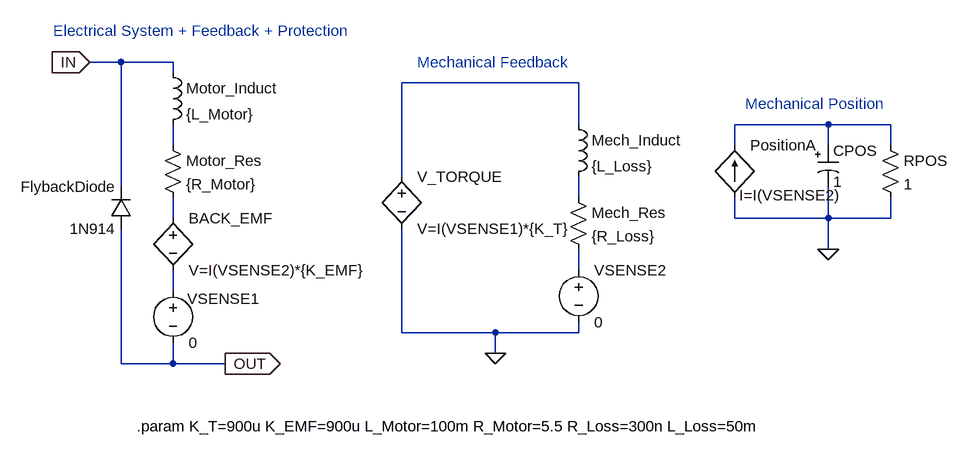
[diagram p0: schematic DCMotorCircuitModel.asc]
DCMotorCircuitModel.asc, the LTspice schematic file:
Version 4
SHEET 1 1356 808
WIRE -176 48 -224 48
WIRE -96 48 -176 48
WIRE -96 64 -96 48
WIRE 528 80 256 80
WIRE 528 144 528 80
WIRE 912 144 768 144
WIRE 1008 144 912 144
WIRE -96 176 -96 144
WIRE 768 176 768 144
WIRE 912 176 912 144
WIRE 1008 176 1008 144
WIRE 256 224 256 80
WIRE -176 240 -176 48
WIRE 528 256 528 224
WIRE -96 288 -96 256
WIRE 768 288 768 256
WIRE 912 288 912 240
WIRE 912 288 768 288
WIRE 1008 288 1008 256
WIRE 1008 288 912 288
WIRE 912 336 912 288
WIRE 528 368 528 336
WIRE -96 400 -96 368
WIRE 256 464 256 304
WIRE 400 464 256 464
WIRE 528 464 528 448
WIRE 528 464 400 464
WIRE 400 496 400 464
WIRE -176 512 -176 304
WIRE -96 512 -96 480
WIRE -96 512 -176 512
WIRE -16 512 -96 512
FLAG -224 48 IN
IOPIN -224 48 In
FLAG -16 512 OUT
IOPIN -16 512 Out
FLAG 400 496 0
FLAG 912 336 0
SYMBOL ind -112 48 R0
SYMATTR InstName Motor_Induct
SYMATTR Value {L_Motor}
SYMBOL res -112 160 R0
SYMATTR InstName Motor_Res
SYMATTR Value {R_Motor}
SYMBOL voltage -96 384 R0
WINDOW 0 22 28 Left 2
SYMATTR InstName VSENSE1
SYMATTR Value 0
SYMBOL voltage 528 352 R0
WINDOW 123 0 0 Left 2
WINDOW 39 0 0 Left 2
SYMATTR InstName VSENSE2
SYMATTR Value 0
SYMBOL ind 512 128 R0
SYMATTR InstName Mech_Induct
SYMATTR Value {L_Loss}
SYMBOL res 512 240 R0
SYMATTR InstName Mech_Res
SYMATTR Value {R_Loss}
SYMBOL polcap 896 176 R0
WINDOW 3 24 56 Left 2
SYMATTR Value 1
SYMATTR InstName CPOS
SYMATTR Description Capacitor
SYMATTR Type cap
SYMATTR SpiceLine V=100 Irms=15m Rser=20 Lser=0 mfg="Nichicon" pn="UPR2A010MAH" type="Al electrolytic"
SYMBOL res 992 160 R0
SYMATTR InstName RPOS
SYMATTR Value 1
SYMBOL bi2 768 176 R0
WINDOW 3 7 77 Left 2
SYMATTR Value I=I(VSENSE2)
SYMATTR InstName PositionA
SYMBOL bv -96 272 R0
SYMATTR InstName BACK_EMF
SYMATTR Value V=I(VSENSE2)*{K_EMF}
SYMBOL bv 256 208 R0
SYMATTR InstName V_TORQUE
SYMATTR Value V=I(VSENSE1)*{K_T}
SYMBOL diode -160 304 R180
WINDOW 0 24 64 Left 2
WINDOW 3 24 0 Left 2
SYMATTR InstName FlybackDiode
SYMATTR Value 1N914
TEXT -152 608 Left 2 !.param K_T=900u K_EMF=900u L_Motor=100m R_Motor=5.5 R_Loss=300n L_Loss=50m
TEXT 280 48 Left 2 ;Mechanical Feedback
TEXT -280 0 Left 2 ;Electrical System + Feedback + Protection
TEXT 784 112 Left 2 ;Mechanical Position

The netlist it stands for:
* DCMotorCircuitModel.asc
L§Motor_Induct IN N003 {L_Motor}
R§Motor_Res N003 N005 {R_Motor}
VSENSE1 N007 OUT 0
VSENSE2 N006 0 0
L§Mech_Induct N001 N004 {L_Loss}
R§Mech_Res N004 N006 {R_Loss}
CPOS N002 0 1 V=100 Irms=15m Rser=20 Lser=0 mfg="Nichicon" pn="UPR2A010MAH" type="Al electrolytic"
RPOS N002 0 1
B§PositionA 0 N002 I=I(VSENSE2)
BACK_EMF N005 N007 V=I(VSENSE2)*{K_EMF}
B§V_TORQUE N001 0 V=I(VSENSE1)*{K_T}
D§FlybackDiode OUT IN 1N914
.model D D
.lib standard.dio
.param K_T=900u K_EMF=900u L_Motor=100m R_Motor=5.5 R_Loss=300n L_Loss=50m
* Mechanical Feedback
* Electrical System + Feedback + Protection
* Mechanical Position
.backanno
.end